# EasyEDA Pro project ProPrj_CyMouse.epro, schematic 主板
Board Name: 主板; Create Date: 2025-09-12; Page Name: P1; Project Name: CyMouse; Schematic Name: 主板; Update Date: 2025-09-17; Company: 嘉立创EDA; Page Size: A4; Version: V1.0
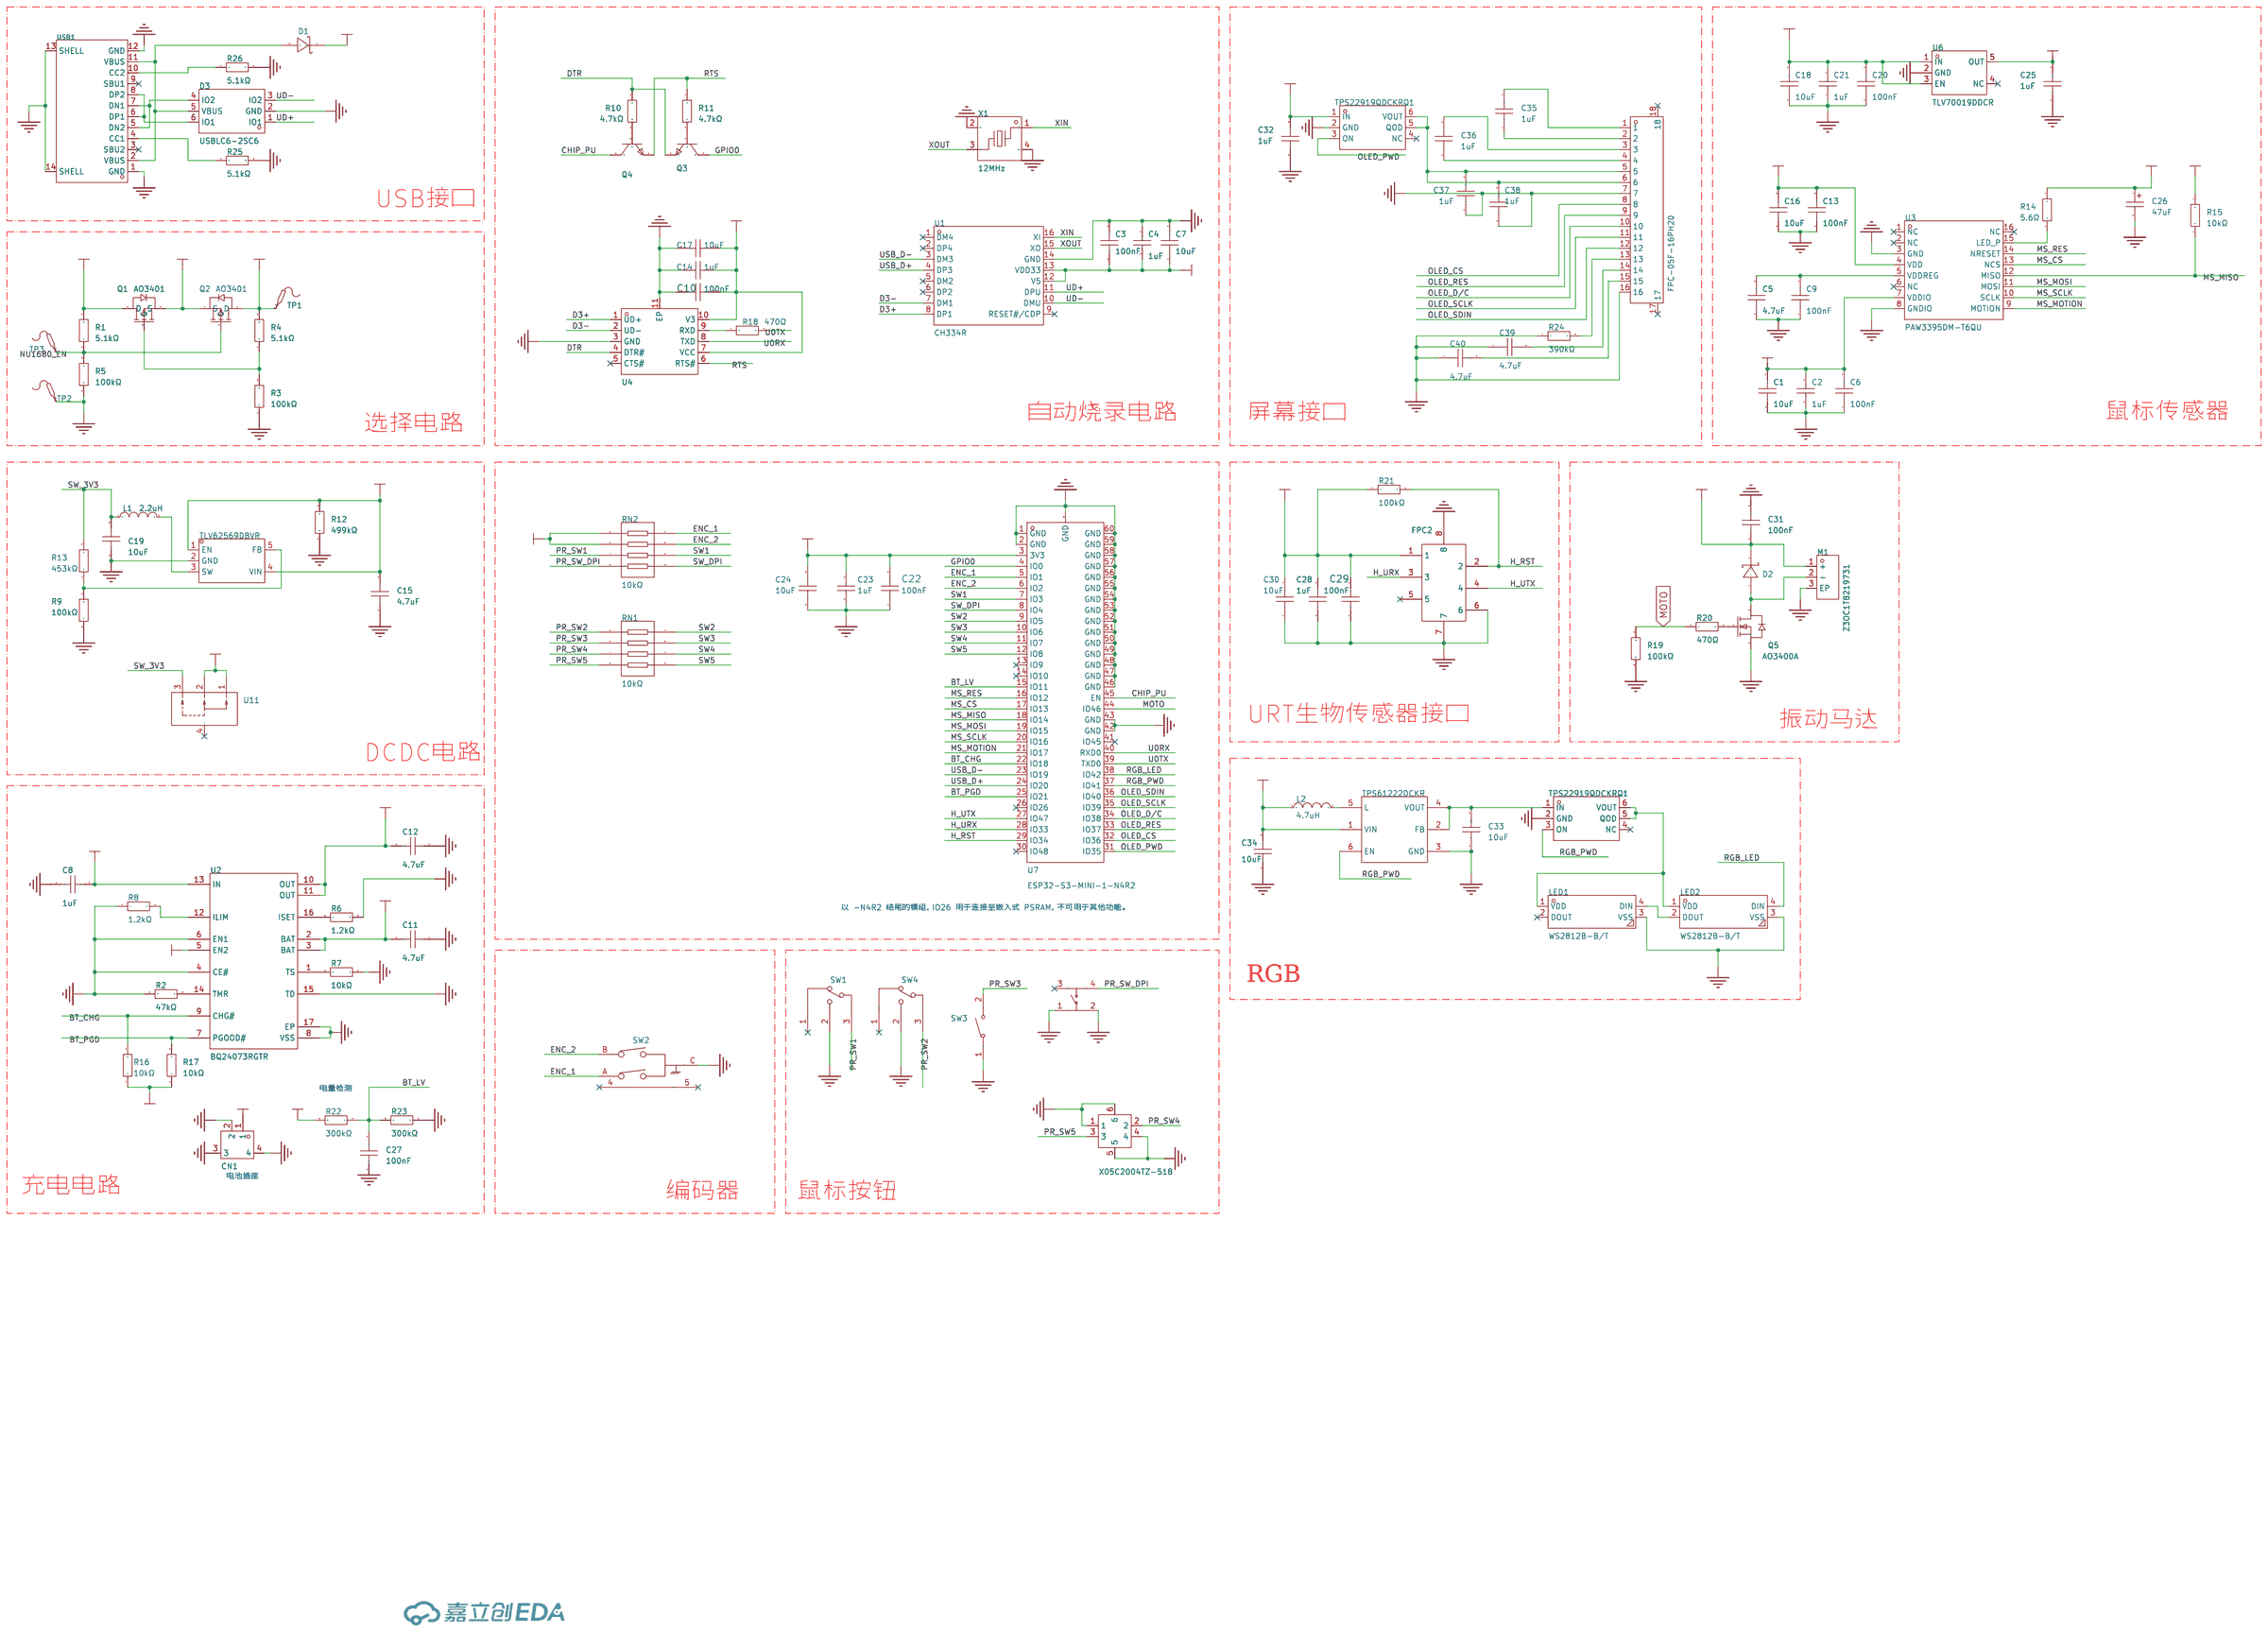
[diagram p0: schematic sheet]

## Parts
C1  10uF  [C0603]
C2  1uF  [C0603]
C3  100nF  [C0603]
C4  1uF  [C0603]
C5  4.7uF  [C0603]
C6  100nF  [C0603]
C7  10uF  [C0603]
C8  1uF  [C0603]
C9  100nF  [C0603]
C10  100nF  [C0603]
C11  4.7uF  [C0603]
C12  4.7uF  [C0603]
C13  100nF  [C0603]
C14  1uF  [C0603]
C15  4.7uF  [C0603]
C16  10uF  [C0603]
C17  10uF  [C0603]
C18  10uF  [C0603]
C19  10uF  [C0603]
C20  100nF  [C0603]
C21  1uF  [C0603]
C22  100nF  [C0603]
C23  1uF  [C0603]
C24  10uF  [C0603]
C25  1uF  [C0603]
C26  47uF  [CASE-A_3216]
C27  100nF  [C0603]
C28  1uF  [C0603]
C29  100nF  [C0603]
C30  10uF  [C0603]
C31  100nF  [C0603]
C32  1uF  [C0603]
C33  10uF  [C0603]
C34  10uF  [C0603]
C35  1uF  [C0603]
C36  1uF  [C0603]
C37  1uF  [C0603]
C38  1uF  [C0603]
C39  4.7uF  [C0603]
C40  4.7uF  [C0603]
CN1  WAFER-MX1.25-2PLB  [CONN-SMD_P1.25_M1250VS-02P]
D1  CUS10S30,H3F  [SOD-323_L1.8-W1.3-LS2.5-RD]
D2  CUS10S30,H3F  [SOD-323_L1.8-W1.3-LS2.5-RD]
D3  USBLC6-2SC6  [SOT-23-6_L2.9-W1.6-P0.95-LS2.8-BL]
DPI1  TS3315A  [SW-SMD_4P-L3.4-W3.4-P2.00-LS4.0]
FPC1  X05C2004TZ-518  [FPC-SMD_4P-P0.50_X05C2004TZ]
FPC2  AFC11-S06ICA-00  [FPC-SMD_6P-P0.50_AFC11-S06ICA-00]
FPC3  FPC-05F-16PH20  [FPC-SMD_16P-P0.50_FPC-05F-16PH20]
L1  2.2uH  [L0603]
L2  4.7uH  [L0603]
LED1  WS2812B-B/T  [LED-SMD_4P-L5.0-W5.0-TL_WS2812B-B]
LED2  WS2812B-B/T  [LED-SMD_4P-L5.0-W5.0-TL_WS2812B-B]
M1  Z3OC1T8219731  [VIBRATING-MOTOR-SMD_3P-C9900001680]
Q1  AO3401  [SOT-23-3_L2.9-W1.4-P1.90-LS2.6-BR]
Q2  AO3401  [SOT-23-3_L2.9-W1.4-P1.90-LS2.6-BR]
Q3  S8050 J3Y(RANGE:200-350)  [SOT-23-3_L3.0-W1.7-P0.95-LS2.9-BR]
Q4  S8050 J3Y(RANGE:200-350)  [SOT-23-3_L3.0-W1.7-P0.95-LS2.9-BR]
Q5  AO3400A  [SOT-23-3_L2.9-W1.3-P1.90-LS2.4-BR]
R1  5.1kΩ  [R0603]
R2  47kΩ  [R0603]
R3  100kΩ  [R0603]
R4  5.1kΩ  [R0603]
R5  100kΩ  [R0603]
R6  1.2kΩ  [R0603]
R7  10kΩ  [R0603]
R8  1.2kΩ  [R0603]
R9  100kΩ  [R0603]
R10  4.7kΩ  [R0603]
R11  4.7kΩ  [R0603]
R12  499kΩ  [R0603]
R13  453kΩ  [R0603]
R14  5.6Ω  [R0603]
R15  10kΩ  [R0603]
R16  10kΩ  [R0603]
R17  10kΩ  [R0603]
R18  470Ω  [R0603]
R19  100kΩ  [R0603]
R20  470Ω  [R0603]
R21  100kΩ  [R0603]
R22  300kΩ  [R0603]
R23  300kΩ  [R0603]
R24  390kΩ  [R0603]
R25  5.1kΩ  [R0603]
R26  5.1kΩ  [R0603]
RN1  10kΩ  [RES-ARRAY-SMD_0603-8P-L3.2-W1.6-BL]
RN2  10kΩ  [RES-ARRAY-SMD_0603-8P-L3.2-W1.6-BL]
SW1  K9-1267T  [SW-TH_K9-1267T]  (no BOM)
SW2  EC10E1220501  [SW-TH_EC10EXXXXXXX]  (no BOM)
SW3  CMI621101D01  [SW-TH_L6.2-W6.2-P5.00]  (no BOM)
SW4  K9-1267T  [SW-TH_K9-1267T]  (no BOM)
TP1  -  [Test-Point-0.5mm]  (no BOM)
TP2  -  [Test-Point-0.5mm]  (no BOM)
TP3  -  [Test-Point-0.5mm]  (no BOM)
U1  CH334R  [QSOP-16_L4.9-W3.9-P0.64-LS6.0-BL]
U2  BQ24073RGTR  [QFN-16_L3.0-W3.0-P0.50-TL-EP1.7]
U3  PAW3395DM-T6QU  [DIP-16_PAW3395DM-T6QU]  (no BOM)
U4  CH340K  [ESOP-10_L4.9-W3.9-P1.00-LS6.2-BL-EP]
U5  TLV62569DBVR  [SOT-23-5_L3.0-W1.7-P0.95-LS2.8-BR]
U6  TLV70019DDCR  [SOT-23-5_L2.9-W1.6-P0.95-LS2.8-BR]
U7  ESP32-S3-MINI-1-N4R2  [BULETM-SMD_ESP32-S3-MINI-1-N8]
U8  TPS22919QDCKRQ1  [SC-70-6_L2.0-W1.3-P0.65-LS2.1-BR]
U9  TPS61222DCKR  [SC-70-6_L2.2-W1.3-P0.65-LS2.1-BR]
U10  TPS22919QDCKRQ1  [SC-70-6_L2.0-W1.3-P0.65-LS2.1-BR]
U11  MSS12C02LS-BB2.0  [SW-SMD_MSS12C02LS-HB2.0-1]
USB1  TYPE-C 16PIN 2MD(073)  [USB-C-SMD_TYPE-C-6PIN-2MD-073]
X1  12MHz  [CRYSTAL-SMD_4P-L2.5-W2.0-BL-A]

## Library data of the parts
C1 C7 C16-C19 C24 C30 C33 C34 = CL10A106KP8NNNC: 容值:10uF;精度:±10%;额定电压:10V;材质(温度系数):X5R;; LCSC Part Name: 10uF ±10% 10V; Supplier Part: C19702; Manufacturer: SAMSUNG(三星); Supplier Footprint: 0603; JLCPCB Part Class: Basic Part; Datasheet: https://atta.szlcsc.com/upload/public/pdf/source/20160218/1457707763339.pdf; Supplier: LCSC; Tolerance: ±10%; Voltage Rated: 10V; Temperature Coefficient: X5R
C2 C4 C8 C14 C21 C23 C25 C28 C32 C35-C38 = CL10A105KO8NNNC: 容值:1uF;精度:±10%;额定电压:16V;材质(温度系数):X5R;; LCSC Part Name: 1uF ±10% 16V; Supplier Part: C1592; Manufacturer: SAMSUNG(三星); Supplier Footprint: 0603; JLCPCB Part Class: Extended Part; Datasheet: https://atta.szlcsc.com/upload/public/pdf/source/20220919/9FBE606BE0D9532D730F292EB26DC5BB.pdf; Supplier: LCSC; Tolerance: ±10%; Voltage Rated: 16V; Temperature Coefficient: X5R
C3 C6 C9 C10 C13 C20 C22 C27 C29 C31 = CL10B104JB8NNNC: 容值:100nF;精度:±5%;额定电压:50V;材质(温度系数):X7R;; LCSC Part Name: 100nF ±5% 50V; Supplier Part: C24452; Manufacturer: SAMSUNG(三星); Supplier Footprint: 0603; JLCPCB Part Class: Extended Part; Datasheet: https://atta.szlcsc.com/upload/public/pdf/source/20160218/1457707763339.pdf; Supplier: LCSC; Tolerance: ±5%; Voltage Rated: 50V; Temperature Coefficient: X7R
C5 C11 C12 C15 C39 C40 = CL10A475KP8NNNC: 容值:4.7uF;精度:±10%;额定电压:10V;材质(温度系数):X5R;; LCSC Part Name: 4.7uF ±10% 10V; Supplier Part: C1705; Manufacturer: SAMSUNG(三星); Supplier Footprint: 0603; JLCPCB Part Class: Extended Part; Datasheet: https://atta.szlcsc.com/upload/public/pdf/source/20160218/1457707763339.pdf; Supplier: LCSC; Tolerance: ±10%; Voltage Rated: 10V; Temperature Coefficient: X5R
C26 = TAJA476K006RNJ: 容值:47uF;精度:±10%;额定电压:6.3V;等效串联电阻(ESR):1.6Ω@100kHz;; LCSC Part Name: 47uF ±10% 6.3V; Supplier Part: C7190; Manufacturer: Kyocera AVX; Supplier Footprint: CASE-A-3216-18(mm); JLCPCB Part Class: 扩展库; Supplier: LCSC; Tolerance: ±10%; Voltage Rating: 6.3V; Equivalent Series Resistance(ESR): 1.6Ω@100kHz; Operating Temperature: -55℃~+125℃
CN1 = WAFER-MX1.25-2PLB: 插针结构:1x2P;间距:1.25mm;安装方式:立贴;参考系列:PicoBlade(MX 1.25);总PIN数:2P;排数:1;每排PIN数:2;行距:-;额定电流:1A;触头材质:黄铜;触头镀层:-;工作温度:-25℃~+85℃;; LCSC Part Name: 1x2P 间距:1.25mm 立贴 系列:PicoBlade(MX 1.25); Supplier Part: C3029350; Manufacturer: XUNPU(讯普); Supplier Footprint: SMD,P=1.25mm; JLCPCB Part Class: Extended Part; Datasheet: https://atta.szlcsc.com/upload/public/pdf/source/20220527/722C84F7ADABCD7FBF13D454629E8231.pdf; Supplier: LCSC; Pins Structure: 1x2P; Pitch: 1.25mm; Mounting Type: 立贴; Reference Series: PicoBlade(MX 1.25); Number of Pins: 2P; Number of Rows: 1; Number of PINs Per Row: 2; Current Rating: 1A; Contact Material: 黄铜; Operating Temperature: -25℃~+85℃; Voltage Rating: 125V; Plastic Material: LCP; Supplementary Features: 辅助焊脚; Color: 米色; Z-Height of the Board: 4.7mm; X-Length of Bottom Edge on Board (Spacing Line): 7.5mm; Y-Width of Bottom Edge on Board: 4.3mm
D1 D2 = CUS10S30,H3F: 正向压降(Vf):230mV@100mA;直流反向耐压(Vr):30V;平均整流电流(Io):1A;; LCSC Part Name: 电压:30V 电流:1A; Supplier Part: C146335; Manufacturer: TOSHIBA(东芝); Supplier Footprint: SC-76(SOD-323); JLCPCB Part Class: Extended Part; Datasheet: https://atta.szlcsc.com/upload/public/pdf/source/20171211/C146335_15129763734771175369.pdf; Supplier: LCSC; Forward Voltage (Vf@If): 230mV@100mA; Reverse Voltage (Vr): 30V; Average Rectified Current (Io): 1A; Reverse Leakage Current (Ir): 500uA@30V
D3 = USBLC6-2SC6_C2827654: 极性:单向;反向截止电压(Vrwm):5V;最大钳位电压:12V;峰值脉冲电流(Ipp):6A;峰值脉冲功率(Ppp):150W;击穿电压:6V;; LCSC Part Name: ESD，可防30kV静电; Supplier Part: C2827654; Manufacturer: TECH PUBLIC(台舟); Supplier Footprint: SOT-23-6; JLCPCB Part Class: Extended Part; Datasheet: https://atta.szlcsc.com/upload/public/pdf/source/20210810/FBD75DE717D6D97BAC6DD7F2B5C09DCD.pdf; Supplier: LCSC; polarity: 单向; Reverse Stand-Off Voltage (Vrwm): 5V; Maximum Clamping Voltage: 12V; Peak Pulse Current (Ipp): 6A; Peak Pulse Power Dissipation (Ppp): 150W; Breakdown Voltage: 6V; Reverse Leakage Current (Ir): 80nA; Number of Lines: 双路; Operating Temperature: -55℃~+125℃; level of protection: IEC 61000-4-2; Type: ESD
DPI1 = TS3315A: 电路结构:单刀单掷;按钮形状:圆形按钮;作用力:5N;安装方式:立贴;开关长度:3.3mm;开关宽度:3.3mm;开关高度:1.5mm;带支架:-;触点电流:50mA;额定电压(AC):-;额定电压(DC):12V;额定功率:-;绝缘电阻:-;带灯:-;机械寿命:-;; LCSC Part Name: 3.3*3.3*1.5mm 立贴 轻触开关; Supplier Part: C412367; Manufacturer: SHOU HAN(首韩); Supplier Footprint: SMD,3.3x3.3mm; JLCPCB Part Class: Extended Part; Datasheet: https://atta.szlcsc.com/upload/public/pdf/source/20190816/C412367_ADDBB226FF931702D65874676D89E2B9.pdf; Supplier: LCSC; Circuit: 单刀单掷; Actuator Style: 圆形按钮; Operating Force: 5N; Mounting Style: 立贴; Switch Length: 3.3mm; Switch Width: 3.3mm; Switch Height: 1.5mm; Contact Current: 50mA; Voltage Rating (DC): 12V
FPC1 = X05C2004TZ: 锁定特性:抽屉式;触点类型:单侧触点/垂直;触点数量:4P;间距:0.5mm;安装方式:立贴;工作温度:-40℃~+85℃;; LCSC Part Name: 间距:0.5mm P数:4P 抽屉式 单侧触点/垂直; Supplier Part: C397314; Manufacturer: XKB Connection(中国星坤); Supplier Footprint: SMD,P=0.5mm; JLCPCB Part Class: Extended Part; Datasheet: https://item.szlcsc.com/datasheet/X05C2004TZ-518/378892.html; Supplier: LCSC; Locking Feature: 抽屉式; Contact Type: 单侧触点/垂直; Number of Contacts: 4P; Pitch: 0.5mm; Mounting Type: 立贴; FFC, FCB Thickness: 0.3mm; Height Above Board: 2mm; Contact Material: 磷青铜; Contact Plating: 锡; Operating Temperature: -40℃~+85℃
FPC2 = AFC11-S06ICA-00: 锁定特性:抽屉式;触点类型:单侧触点/垂直;触点数量:6P;间距:0.5mm;安装类型:立贴;; LCSC Part Name: 间距:0.5mm P数:6P 抽屉式 单侧触点/垂直; Supplier Part: C262496; Manufacturer: JS(钜硕电子); Supplier Footprint: SMD,P=0.5mm; JLCPCB Part Class: 扩展库; Datasheet: https://atta.szlcsc.com/upload/public/pdf/source/20191211/C466537_F6F2472ADACFFA77E875AFE9DAB8E0AD.pdf; Supplier: LCSC; Locking Feature: 抽屉式; Contact Type: 单侧触点/垂直; Number of Contacts: 6P; Pitch: 0.5mm; Mounting Type: 立贴; FFC, FCB Thickness: 0.3mm; Height Above Board: 4.4mm
FPC3 = FPC-05F-16PH20: 锁定特性:翻盖式;触点类型:下接;触点数量:16P;间距:0.5mm;安装类型:卧贴;工作温度范围:-25℃~+85℃;; LCSC Part Name: 间距:0.5mm P数:16P 翻盖式 下接; Supplier Part: C2856801; Manufacturer: XUNPU(讯普); Supplier Footprint: SMD,P=0.5mm,卧贴; JLCPCB Part Class: 扩展库; Datasheet: https://atta.szlcsc.com/upload/public/pdf/source/20210922/C2856801_73A554E58C5577257FCEC843978D3BA6.pdf; Supplier: LCSC; Locking Feature: 翻盖式; Contact Type: 下接; Number of Contacts: 16P; Pitch: 0.5mm; Mounting Type: 卧贴; FFC, FCB Thickness: 0.3mm; Height Above Board: 2mm; Operating Temperature Range: -25℃~+85℃
L1 = LQM18PN2R2MFRL: 电感值:2.2uH;精度:±20%;额定电流:750mA;饱和电流(Isat):-;直流电阻(DCR):300mΩ;; LCSC Part Name: 2.2uH ±20%; Supplier Part: C337910; Manufacturer: muRata(村田); Supplier Footprint: 0603; JLCPCB Part Class: Extended Part; Datasheet: https://atta.szlcsc.com/upload/public/pdf/source/20190301/C337910_27DA25781C95F885577870A93A746ADF.pdf; Supplier: LCSC; Tolerance: ±20%; Rated Current: 750mA; DC Resistance (DCR): 300mΩ; Frequency - Self Resonant: 70MHz
L2 = LQM18PN4R7MFRL: 电感值:4.7uH;精度:±20%;额定电流:620mA;饱和电流(Isat):-;直流电阻(DCR):440mΩ;; LCSC Part Name: 4.7uH ±20%; Supplier Part: C114862; Manufacturer: muRata(村田); Supplier Footprint: 0603; JLCPCB Part Class: Extended Part; Datasheet: https://atta.szlcsc.com/upload/public/pdf/source/20190906/C114862_C649894BBFA3713544D63EDDE3C83B81.pdf; Supplier: LCSC; Tolerance: ±20%; Rated Current: 620mA; DC Resistance (DCR): 440mΩ; Frequency - Self Resonant: 40MHz
LED1 LED2 = WS2812B-B/T: 黑支架，雾状，发光更均匀，适合黑色结构产品（注意防潮，请查阅规格书中对应具体内容）; LCSC Part Name: RGB三色; Supplier Part: C2761795; Manufacturer: worldsemi; Supplier Footprint: SMD5050; JLCPCB Part Class: 扩展库; Datasheet: https://atta.szlcsc.com/upload/public/pdf/source/20241202/30EABD03362326C22309ED3654C53350.pdf; Supplier: LCSC; Wavelength: 520nm；471nm；621nm
M1 = Z3OC1T8219731: 类型:圆柱直流马达;额定电压:2.7V;额定转速:14000±2500rpm;旋转方向:CW;; Supplier Part: C2894731; Manufacturer: KOTL(金龙机电); JLCPCB Part Class: 扩展库; Datasheet: https://atta.szlcsc.com/upload/public/pdf/source/20210908/21604D4C77F5141C93AFC2CF1DCB74B9.pdf; Supplier: LCSC; Type: 圆柱直流马达; Voltage Rating: 2.7V; Current Rating: 85mA; Rated Speed: 14000±2500rpm; Operating Temperature: -20℃~+70℃; Sense Of Rotation: CW; Rated Voltage: 2.7V; Rated Current: 85mA
Q1 Q2 = AO3401_C727156: 数量:1个P沟道;漏源电压(Vdss):30V;连续漏极电流(Id):4.2A;导通电阻(RDS(on)):65mΩ@10V,4.2A;耗散功率(Pd):350mW;阈值电压(Vgs(th)):1.3V;; LCSC Part Name: 1个P沟道 耐压:30V 电流:4.2A; Supplier Part: C727156; Manufacturer: TWGMC(迪嘉); Supplier Footprint: SOT-23; JLCPCB Part Class: Extended Part; Datasheet: https://item.szlcsc.com/datasheet/AO3401/774261.html; Supplier: LCSC; Type: 1个P沟道; Drain Source Voltage (Vdss): 30V; Continuous Drain Current (Id): 4.2A; Power Dissipation (Pd): 350mW; Drain Source On Resistance (RDS(on)@Vgs,Id): 65mΩ@10V,4.2A; Gate Threshold Voltage (Vgs(th)@Id): 1.3V@250uA; Reverse Transfer Capacitance (Crss@Vds): 77pF; Operating Temperature: -55℃~+150℃; Number: 1个P沟道; Drain to Source Voltage: 30V; Current - Continuous Drain(Id): 4.2A; RDS(on): 65mΩ@10V,4.2A; Pd - Power Dissipation: 350mW; Gate Threshold Voltage (Vgs(th)): 1.3V; Input Capacitance(Ciss): 954pF
Q3 Q4 = S8050 J3Y(RANGE:200-350): 晶体管类型:NPN;集电极电流(Ic):500mA;集射极击穿电压(Vceo):25V;耗散功率(Pd):300mW;直流电流增益(hFE):200@500mA,1V;; LCSC Part Name: H档(200-350); Supplier Part: C2146; Manufacturer: CJ(江苏长电/长晶); Supplier Footprint: SOT-23; JLCPCB Part Class: Basic Part; Datasheet: https://atta.szlcsc.com/upload/public/pdf/source/20231013/FF37B6A000E6CDA75C9C999D2E78731F.pdf; Supplier: LCSC; type: NPN; Current - Collector(Ic): 500mA; Collector - Emitter Voltage VCEO: 25V; Pd - Power Dissipation: 300mW; DC Current Gain: 200@500mA,1V; Transition frequency(fT): 150MHz; Current - Collector Cutoff: 100nA; Vce Saturation(VCE(sat)): 600mV; Operating Temperature: -55℃~+150℃
Q5 = AO3400A_C347475: 类型:1个N沟道;漏源电压(Vdss):30V;连续漏极电流(Id):5.8A;功率(Pd):1.4W;导通电阻(RDS(on)@Vgs,Id):35mΩ@10V,5.8A;阈值电压(Vgs(th)@Id):1.4V@250uA;; LCSC Part Name: 1个N沟道 耐压:30V 电流:5.8A; Supplier Part: C347475; Manufacturer: UMW(友台半导体); Supplier Footprint: SOT-23; JLCPCB Part Class: 扩展库; Datasheet: https://atta.szlcsc.com/upload/public/pdf/source/20231109/50AB4FB4D66E55864F9B8D027B723C9A.pdf; Supplier: LCSC; Type: 1个N沟道; Drain Source Voltage (Vdss): 30V; Continuous Drain Current (Id): 5.8A; Power Dissipation (Pd): 1.4W; Drain Source On Resistance (RDS(on)@Vgs,Id): 35mΩ@10V,5.8A; Gate Threshold Voltage (Vgs(th)@Id): 1.4V@250uA; Total Gate Charge (Qg@Vgs): 12nC@4.5V; Input Capacitance (Ciss@Vds): 1.05nF@15V; Operating Temperature: -55℃~+150℃@(Tj)
R1 R4 R25 R26 = 0603WAF5101T5E: 电阻类型:厚膜电阻;阻值:5.1kΩ;精度:±1%;功率:100mW;最大工作电压:75V;温度系数:±100ppm/℃;; LCSC Part Name: 5.1kΩ ±1% 100mW 厚膜电阻; Supplier Part: C23186; Manufacturer: UNI-ROYAL(厚声); Supplier Footprint: 0603; JLCPCB Part Class: Basic Part; Datasheet: https://atta.szlcsc.com/upload/public/pdf/source/20200306/C422600_1E6D84923E4A46A82E41ADD87F860B5C.pdf; Supplier: LCSC; Type: 厚膜电阻; Tolerance: ±1%; Power(Watts): 100mW; Overload Voltage (Max): 75V; Temperature Coefficient: ±100ppm/℃; Operating Temperature Range: -55℃~+155℃
R2 = FRC0603F4702TS: 电阻类型:厚膜电阻;阻值:47kΩ;精度:±1%;功率:100mW;最大工作电压:75V;温度系数:±100ppm/℃;; LCSC Part Name: 47kΩ ±1% 100mW 厚膜电阻; Supplier Part: C2907042; Manufacturer: FOJAN(富捷); Supplier Footprint: 0603; JLCPCB Part Class: Extended Part; Datasheet: https://atta.szlcsc.com/upload/public/pdf/source/20211221/925EC7D7225764EE0046F22065062C87.pdf; Supplier: LCSC; Type: 厚膜电阻; Tolerance: ±1%; Power(Watts): 100mW; Overload Voltage (Max): 75V; Temperature Coefficient: ±100ppm/℃; Operating Temperature Range: -55℃~+155℃
R3 R5 R9 R19 R21 = 0603WAF1003T5E: 电阻类型:厚膜电阻;阻值:100kΩ;精度:±1%;功率:100mW;最大工作电压:75V;温度系数:±100ppm/℃;; LCSC Part Name: 100kΩ ±1% 100mW 厚膜电阻; Supplier Part: C25803; Manufacturer: UNI-ROYAL(厚声); Supplier Footprint: 0603; JLCPCB Part Class: Basic Part; Datasheet: https://atta.szlcsc.com/upload/public/pdf/source/20200306/C422600_1E6D84923E4A46A82E41ADD87F860B5C.pdf; Supplier: LCSC; Type: 厚膜电阻; Tolerance: ±1%; Power(Watts): 100mW; Overload Voltage (Max): 75V; Temperature Coefficient: ±100ppm/℃; Operating Temperature Range: -55℃~+155℃
R6 R8 = 0603WAF1201T5E: 电阻类型:厚膜电阻;阻值:1.2kΩ;精度:±1%;功率:100mW;最大工作电压:75V;温度系数:±100ppm/℃;; LCSC Part Name: 1.2kΩ ±1% 100mW 厚膜电阻; Supplier Part: C22765; Manufacturer: UNI-ROYAL(厚声); Supplier Footprint: 0603; JLCPCB Part Class: Basic Part; Datasheet: https://atta.szlcsc.com/upload/public/pdf/source/20200306/C422600_1E6D84923E4A46A82E41ADD87F860B5C.pdf; Supplier: LCSC; Type: 厚膜电阻; Tolerance: ±1%; Power(Watts): 100mW; Overload Voltage (Max): 75V; Temperature Coefficient: ±100ppm/℃; Operating Temperature Range: -55℃~+155℃
R7 R15-R17 = 0603WAF1002T5E: 电阻类型:厚膜电阻;阻值:10kΩ;精度:±1%;功率:100mW;最大工作电压:75V;温度系数:±100ppm/℃;; LCSC Part Name: 厚膜电阻 10kΩ ±1% 100mW; Supplier Part: C25804; Manufacturer: UNI-ROYAL(厚声); Supplier Footprint: 0603; JLCPCB Part Class: Basic Part; Datasheet: https://atta.szlcsc.com/upload/public/pdf/source/20200306/C422600_1E6D84923E4A46A82E41ADD87F860B5C.pdf; Supplier: LCSC; Type: 厚膜电阻; Tolerance: ±1%; Power(Watts): 100mW; Overload Voltage (Max): 75V; Temperature Coefficient: ±100ppm/℃; Operating Temperature Range: -55℃~+155℃
R10 R11 = 0603WAF4701T5E: 电阻类型:厚膜电阻;阻值:4.7kΩ;精度:±1%;功率:100mW;最大工作电压:75V;温度系数:±100ppm/℃;; LCSC Part Name: 4.7kΩ ±1% 100mW 厚膜电阻; Supplier Part: C23162; Manufacturer: UNI-ROYAL(厚声); Supplier Footprint: 0603; JLCPCB Part Class: Basic Part; Datasheet: https://atta.szlcsc.com/upload/public/pdf/source/20200306/C422600_1E6D84923E4A46A82E41ADD87F860B5C.pdf; Supplier: LCSC; Type: 厚膜电阻; Tolerance: ±1%; Power(Watts): 100mW; Overload Voltage (Max): 75V; Temperature Coefficient: ±100ppm/℃; Operating Temperature Range: -55℃~+155℃
R12 = 0603WAF4993T5E: 电阻类型:厚膜电阻;阻值:499kΩ;精度:±1%;功率:100mW;最大工作电压:75V;温度系数:±100ppm/℃;; LCSC Part Name: 499kΩ ±1% 100mW 厚膜电阻; Supplier Part: C26751; Manufacturer: UNI-ROYAL(厚声); Supplier Footprint: 0603; JLCPCB Part Class: Extended Part; Datasheet: https://atta.szlcsc.com/upload/public/pdf/source/20200306/C422600_1E6D84923E4A46A82E41ADD87F860B5C.pdf; Supplier: LCSC; Type: 厚膜电阻; Tolerance: ±1%; Power(Watts): 100mW; Overload Voltage (Max): 75V; Temperature Coefficient: ±100ppm/℃; Operating Temperature Range: -55℃~+155℃
R13 = 0603WAF4533T5E: 电阻类型:厚膜电阻;阻值:453kΩ;精度:±1%;功率:100mW;最大工作电压:75V;温度系数:±100ppm/℃;; LCSC Part Name: 453kΩ ±1% 100mW 厚膜电阻; Supplier Part: C25818; Manufacturer: UNI-ROYAL(厚声); Supplier Footprint: 0603; JLCPCB Part Class: Extended Part; Datasheet: https://atta.szlcsc.com/upload/public/pdf/source/20200306/C422600_1E6D84923E4A46A82E41ADD87F860B5C.pdf; Supplier: LCSC; Type: 厚膜电阻; Tolerance: ±1%; Power(Watts): 100mW; Overload Voltage (Max): 75V; Temperature Coefficient: ±100ppm/℃; Operating Temperature Range: -55℃~+155℃
R14 = 0603WAF560KT5E: 电阻类型:厚膜电阻;阻值:5.6Ω;精度:±1%;功率:100mW;最大工作电压:75V;温度系数:±200ppm/℃;; LCSC Part Name: 5.6Ω ±1% 100mW 厚膜电阻; Supplier Part: C23191; Manufacturer: UNI-ROYAL(厚声); Supplier Footprint: 0603; JLCPCB Part Class: Extended Part; Datasheet: https://atta.szlcsc.com/upload/public/pdf/source/20200306/C422600_1E6D84923E4A46A82E41ADD87F860B5C.pdf; Supplier: LCSC; Type: 厚膜电阻; Tolerance: ±1%; Power(Watts): 100mW; Overload Voltage (Max): 75V; Temperature Coefficient: ±200ppm/℃; Operating Temperature Range: -55℃~+155℃
R18 R20 = 0603WAF4700T5E: 电阻类型:厚膜电阻;阻值:470Ω;精度:±1%;功率:100mW;最大工作电压:75V;温度系数:±100ppm/℃;; LCSC Part Name: 470Ω ±1% 100mW 厚膜电阻; Supplier Part: C23179; Manufacturer: UNI-ROYAL(厚声); Supplier Footprint: 0603; JLCPCB Part Class: Basic Part; Datasheet: https://atta.szlcsc.com/upload/public/pdf/source/20200306/C422600_1E6D84923E4A46A82E41ADD87F860B5C.pdf; Supplier: LCSC; Type: 厚膜电阻; Tolerance: ±1%; Power(Watts): 100mW; Overload Voltage (Max): 75V; Temperature Coefficient: ±100ppm/℃; Operating Temperature Range: -55℃~+155℃
R22 R23 = 0603WAF3003T5E: 电阻类型:厚膜电阻;阻值:300kΩ;精度:±1%;功率:100mW;最大工作电压:75V;温度系数:±100ppm/℃;; LCSC Part Name: 300kΩ ±1% 100mW 厚膜电阻; Supplier Part: C23024; Manufacturer: UNI-ROYAL(厚声); Supplier Footprint: 0603; JLCPCB Part Class: Basic Part; Datasheet: https://atta.szlcsc.com/upload/public/pdf/source/20200306/C422600_1E6D84923E4A46A82E41ADD87F860B5C.pdf; Supplier: LCSC; Type: 厚膜电阻; Tolerance: ±1%; Power(Watts): 100mW; Overload Voltage (Max): 75V; Temperature Coefficient: ±100ppm/℃; Operating Temperature Range: -55℃~+155℃
R24 = 0603WAF3903T5E: 电阻类型:厚膜电阻;阻值:390kΩ;精度:±1%;功率:100mW;最大工作电压:75V;温度系数:±100ppm/℃;; LCSC Part Name: 390kΩ ±1% 100mW 厚膜电阻; Supplier Part: C23150; Manufacturer: UNI-ROYAL(厚声); Supplier Footprint: 0603; JLCPCB Part Class: Extended Part; Datasheet: https://atta.szlcsc.com/upload/public/pdf/source/20200306/C422600_1E6D84923E4A46A82E41ADD87F860B5C.pdf; Supplier: LCSC; Type: 厚膜电阻; Tolerance: ±1%; Power(Watts): 100mW; Overload Voltage (Max): 75V; Temperature Coefficient: ±100ppm/℃; Operating Temperature Range: -55℃~+155℃
RN1 RN2 = YC164-FR-0710KL: 电阻器数:4;阻值:10kΩ;精度:±1%;单个元件功率:62.5mW;温度系数:±200ppm/℃;; LCSC Part Name: 10kΩ ±1% 0603x4; Supplier Part: C110924; Manufacturer: YAGEO(国巨); Supplier Footprint: 0603x4; JLCPCB Part Class: 扩展库; Datasheet: https://atta.szlcsc.com/upload/public/pdf/source/20170912/C110924_1505207735334963352.pdf; Supplier: LCSC; Number of Resistors: 4; Tolerance: ±1%; Power(Watts): 62.5mW; Temperature Coefficient: ±200ppm/℃; Number of Pins: 8
SW1 SW4 = K9-1267T: 类型:微动开关;电路结构:单刀双掷;额定电流(DC):100mA;额定电压(DC):30V;额定电流(AC):-;额定电压(AC):-;机械寿命:300万次;; LCSC Part Name: 12.7*5.7*7.5mm 插件微动开关; Supplier Part: C107266; Manufacturer: 韩国韩荣; Supplier Footprint: 插件; JLCPCB Part Class: 扩展库; Datasheet: https://atta.szlcsc.com/upload/public/pdf/source/20170413/1492062748888.pdf; Supplier: LCSC; Type: 微动开关; Circuit: 单刀双掷; Switch Length: 12.7mm; Switch Width: 5.7mm; Switch Height: 7.5mm; Contact Current (DC): 100mA; Voltage Rating (DC): 30V; Mechanical Life: 300万次; Operating Temperature: -25℃~+85℃
SW2 = EC10E1220501: 10型贯通轴型; Supplier Part: C160889; Manufacturer: ALPSALPINE(阿尔卑斯阿尔派); Supplier Footprint: 插件; JLCPCB Part Class: 扩展库; Datasheet: https://atta.szlcsc.com/upload/public/pdf/source/20180227/C160889_15197014267581370273.pdf; Supplier: LCSC
SW3 = CMI621101D01: Supplier Part: C400269; Manufacturer: Kailh(凯华); Supplier Footprint: 插件; JLCPCB Part Class: Extended Part; Datasheet: https://atta.szlcsc.com/upload/public/pdf/source/20190626/C400269_AFEF00833BA31A55037065A2F8D3A334.pdf; Supplier: LCSC
TP1-TP3 = Test-Point: Test Point 测试点
U1 = CH334R: Supplier Part: C4154405; Manufacturer: WCH(南京沁恒); Supplier Footprint: QSOP-16-150mil; JLCPCB Part Class: 扩展库; Datasheet: https://atta.szlcsc.com/upload/public/pdf/source/20240313/F70B229B132CE2CA6E618A7ACAF406E8.pdf; Supplier: LCSC
U2 = BQ24073RGTR: 工作电压:4.35V~6.6V;最大充电电流:-;电池类型:锂离子/聚合物;电池节数:1;; Supplier Part: C15220; Manufacturer: TI(德州仪器); Supplier Footprint: QFN-16-EP(3x3); JLCPCB Part Class: 扩展库; Datasheet: http://www.ti.com/cn/lit/gpn/bq24075; Supplier: LCSC; Voltage - Supply: 4.35V~6.6V; Charging Saturation Voltage: 4.2V; Type of Battery: 锂离子/聚合物; Number of Cells: 1; Operating Temperature: -40℃~+85℃
U3 = PAW3395DM-T6QU: Supplier Part: C9900026543; Supplier Footprint: 16-PDIP; Supplier: LCSC
U4 = CH340K: 应用功能:-;接口协议:-;; LCSC Part Name: CH340K USB转串口芯片 CH340; Supplier Part: C968586; Manufacturer: WCH(南京沁恒); Supplier Footprint: ESOP-10-EP-150mil; JLCPCB Part Class: 扩展库; Datasheet: https://atta.szlcsc.com/upload/public/pdf/source/20200819/C84681_ADBED554CE321879DBD6B1D06488689C.pdf; Supplier: LCSC
U5 = TLV62569DBVR: 功能类型:降压型;输出类型:可调;工作电压:2.5V~5.5V;输出电压:600mV~5.5V;输出电流:2A;; LCSC Part Name: 高效率同步降压转换器; Supplier Part: C141836; Manufacturer: TI(德州仪器); Supplier Footprint: SOT-23-5; JLCPCB Part Class: 扩展库; Datasheet: https://www.ti.com/cn/lit/gpn/tlv62569; Supplier: LCSC; Function: 降压型; Output Type: 可调; Voltage - Supply: 2.5V~5.5V; Output Voltage: 600mV~5.5V; Output Current: 2A; Frequency - Switching: 1.5MHz; Operating Temperature: -40℃~+125℃@(TJ); Synchronous Rectifier: 是; Number of Outputs: 1; Topology: 降压式; Switch tube (built-in/external): 内置
U6 = TLV70019DDCR: 输出类型:固定;最大输入电压:5.5V;输出电压:1.9V;输出电流:200mA;电源纹波抑制比(PSRR):68dB@(1kHz);输出极性:正极;; LCSC Part Name: 具有使能功能的 200mA、高 PSRR、低 IQ、低压降稳压器; Supplier Part: C2862411; Manufacturer: TI(德州仪器); Supplier Footprint: SOT-23-5; JLCPCB Part Class: 扩展库; Datasheet: https://www.ti.com/cn/lit/gpn/tlv700; Supplier: LCSC; Output Type: 固定; Maximum Input Voltage: 5.5V; Output Voltage: 1.9V; Output Current: 200mA; Power Supply Rejection Ratio (PSRR): 68dB@(1kHz); Dropout Voltage: 250mV@(200mA); standby current: 55uA; Feature: 防静电保护；低ESR；热保护(TSD)；欠压闭锁；过流保护(OCP)；带使能; Operating Temperature: -40℃~+125℃@(Tj); Output Polarity: 正极; Number of Outputs: 1
U7 = ESP32-S3-MINI-1-N4R2: 天线形式:板载PCB天线;; Supplier Part: C3013941; Manufacturer: ESPRESSIF(乐鑫); Supplier Footprint: SMD; JLCPCB Part Class: 扩展库; Datasheet: https://item.szlcsc.com/datasheet/ESP32-S3-MINI-1-N4R2/3522411.html; Supplier: LCSC; Antenna Type: 板载PCB天线
U8 U10 = TPS22919QDCKRQ1: 通道数:1;输出电流:1.5A;输入电压:1.6V~5.5V;导通电阻:89mΩ;; Supplier Part: C2871558; Manufacturer: TI(德州仪器); Supplier Footprint: SC-70-6; JLCPCB Part Class: 扩展库; Datasheet: https://www.ti.com/cn/lit/gpn/tps22919-q1; Supplier: LCSC; Number of Outputs: 1; Output Current: 1.5A; Input Voltage: 1.6V~5.5V; Resistor On-State: 89mΩ; Operating Temperature	-: -40℃~+125℃
U9 = TPS61222DCKR: 功能类型:升压型;输出类型:固定;工作电压:700mV~5.5V;输出电压:5V;输出电流:200mA;; LCSC Part Name: 低输入电压0.7V升压转换器; Supplier Part: C116461; Manufacturer: TI(德州仪器); Supplier Footprint: SC-70-6(SOT-363); JLCPCB Part Class: 扩展库; Datasheet: https://www.ti.com/cn/lit/gpn/tps61222; Supplier: LCSC; Function: 升压型; Output Type: 固定; Voltage - Supply: 700mV~5.5V; Output Voltage: 5V; Output Current: 200mA; Operating Temperature: -40℃~+125℃@(TJ); Synchronous Rectifier: 是; Number of Outputs: 1; Topology: 升压式; Switch tube (built-in/external): 内置
U11 = MSS12C02LS-BB2.0: 电路结构:单刀双掷;安装方式:立贴;开关颜色:-;额定电流(DC):100mA;额定电压(DC):12V;额定电流(AC):-;额定电压(AC):-;机械寿命:1万次;; Supplier Part: C3008585; Manufacturer: SHOU HAN(首韩); Supplier Footprint: SMD; JLCPCB Part Class: Extended Part; Datasheet: https://atta.szlcsc.com/upload/public/pdf/source/20220429/8AEFBC67104491914BC5659DE1F359A3.pdf; Supplier: LCSC; Circuit: 单刀双掷; Pin Style: SMD接片; Switch Length: 6.65mm; Switch Width: 2.75mm; Switch Height: 1.4mm; Mounting Style: 立贴; Current Rating (DC): 100mA; Voltage Rating (DC): 12V; Mechanical Life: 1万次; Operating Temperature: -25℃~+70℃
USB1 = TYPE-C 16PIN 2MD(073): 连接器类型:Type-C;标准:-;公母:母座;触点数量:16;端口数量:1;安装方式:卧贴;额定电流 - 电源:5A;工作温度范围:-25℃~+85℃;; LCSC Part Name: TYPE-C母座 16P 4脚插件带定位柱 不锈钢外壳 2次模顶; Supplier Part: C2765186; Manufacturer: SHOU HAN(首韩); Supplier Footprint: SMD; JLCPCB Part Class: Extended Part; Supplier: LCSC; Connector Type: Type-C; Gender: 母座; Number of Contacts: 16; Number of Ports: 1; Mounting Style: 卧贴; Current Rating - Power (Max): 5A; Operating Temperature Range: -25℃~+85℃
X1 = X252012MMB4SI-24: 频率:12MHz;频率公差:±10ppm;负载电容:10pF;; LCSC Part Name: 12MHz ±10ppm 10pF YSX221SL; Supplier Part: C2896601; Manufacturer: YXC(扬兴晶振); Supplier Footprint: SMD2520-4P; JLCPCB Part Class: 扩展库; Datasheet: https://atta.szlcsc.com/upload/public/pdf/source/20210917/7E0AFFDD74AE514FE25E1ADDD9E3C073.pdf; Supplier: LCSC; Crystal Type: 贴片无源晶振; Frequency Tolerance: ±10ppm; Frequency Stability: ±20ppm; Load Capacitance: 10pF; Operating Temperature: -40℃~+85℃

## Nets
1.9V: C13.2 C16.2 C25.2 C26.1 R14.2 U3.4(VDD) U6.5(OUT)
3V3: C1.2 C2.2 C3.1 C4.1 C6.2 C7.1 C10.1 C14.1 C17.1 C18.2 C20.2 C21.2 C22.2 C23.2 C24.2 C28.2 C29.2 C30.2 C31.1 C32.2 C34.2 D2.1(K) FPC2.1 L2.1 M1.1(+) R15.2 R16.1 R17.1 R21.1 RN2.5 RN2.6 U1.12(V5) U1.13(VDD33) U3.7(VDDIO) U4.7(VCC) U4.10(V3) U6.1(IN) U6.3(EN) U7.3(3V3) U8.1(IN) U9.1(VIN) U11.1 U11.2
5V: C12.2 C15.2 R12.2 U2.5(EN2) U2.10(OUT) U2.11(OUT) U5.1(EN) U5.4(VIN)
GND: C1.1 C2.1 C3.2 C4.2 C5.1 C6.1 C7.2 C8.2 C9.1 C10.2 C11.1 C12.1 C13.1 C14.2 C15.1 C16.1 C17.2 C18.1 C19.1 C20.1 C21.1 C22.1 C23.1 C24.1 C25.1 C26.2 C27.1 C28.1 C29.1 C30.1 C31.2 C32.1 C33.1 C34.1 C37.1 C38.1 C39.1 C40.1 CN1.2 CN1.3 CN1.4 D3.2(GND) DPI1.1 DPI1.2 FPC1.1 FPC1.4 FPC1.5 FPC1.6 FPC2.6 FPC2.7 FPC2.8 FPC3.7 FPC3.16 LED1.3(VSS) LED2.3(VSS) M1.3(EP) Q5.2(S) R2.1 R3.1 R5.1 R6.2 R7.1 R8.1 R9.1 R12.1 R19.1 R23.1 R24.1 R25.2 R26.2 SW1.2(ON) SW2.C SW3.1(A) SW4.2(ON) TP2.1 U1.14(GND) U2.4(CE#) U2.6(EN1) U2.8(VSS) U2.15(TD) U2.17(EP) U3.3(GND) U3.8(GNDIO) U4.3(GND) U4.11(EP) U5.2(GND) U6.2(GND) U7.1(GND) U7.2(GND) U7.42(GND) U7.43(GND) U7.46(GND) U7.47(GND) U7.48(GND) U7.49(GND) U7.50(GND) U7.51(GND) U7.52(GND) U7.53(GND) U7.54(GND) U7.55(GND) U7.56(GND) U7.57(GND) U7.58(GND) U7.59(GND) U7.60(GND) U7.GND U8.2(GND) U9.3(GND) U10.2(GND) USB1.1(GND) USB1.12(GND) USB1.13(SHELL) USB1.14(SHELL) X1.2(GND) X1.4(GND)
VBAT: C11.2 CN1.1 R22.2 U2.2(BAT) U2.3(BAT)
VBUS: D1.1(K) Q1.3(D) R1.2
BT_CHG: R16.2 U2.9(CHG#) U7.22(IO18)
BT_LV: C27.2 R22.1 R23.2 U7.15(IO11)
BT_PGD: R17.2 U2.7(PGOOD#) U7.25(IO21)
CHIP_PU: Q4.3(C) U7.45(EN)
D3+: U1.8(DP1) U4.1(UD+)
D3-: U1.7(DM1) U4.2(UD-)
DTR: Q3.2(E) R10.1 U4.4(DTR#)
ENC_1: RN2.4 SW2.A U7.5(IO1)
ENC_2: RN2.3 SW2.B U7.6(IO2)
GPIO0: Q3.3(C) U7.4(IO0)
H_RST: FPC2.2 R21.2 U7.29(IO34)
H_URX: FPC2.3 U7.28(IO33)
H_UTX: FPC2.4 U7.27(IO47)
MOTO: R19.2 R20.1 U7.44(IO46)
MS_CS: U3.13(NCS) U7.17(IO13)
MS_MISO: R15.1 U3.12(MISO) U7.18(IO14)
MS_MOSI: U3.11(MOSI) U7.19(IO15)
MS_MOTION: U3.9(MOTION) U7.21(IO17)
MS_RES: U3.14(NRESET) U7.16(IO12)
MS_SCLK: U3.10(SCLK) U7.20(IO16)
NU1680_EN: Q2.1(G) R1.1 R5.2 TP3.1
OLED_CS: FPC3.8 U7.32(IO36)
OLED_D/C: FPC3.10 U7.34(IO38)
OLED_PWD: U7.31(IO35) U8.3(ON)
OLED_RES: FPC3.9 U7.33(IO37)
OLED_SCLK: FPC3.11 U7.35(IO39)
OLED_SDIN: FPC3.12 U7.36(IO40)
PR_SW1: RN2.7 SW1.3(NC)
PR_SW2: RN1.5 SW4.3(NC)
PR_SW3: RN1.6 SW3.2(B)
PR_SW4: FPC1.2 RN1.7
PR_SW5: FPC1.3 RN1.8
PR_SW_DPI: DPI1.4 RN2.8
RGB_LED: LED2.4(DIN) U7.38(IO42)
RGB_PWD: U7.37(IO41) U9.6(EN) U10.3(ON)
RTS: Q4.2(E) R11.1 U4.6(RTS#)
SW1: RN2.2 U7.7(IO3)
SW2: RN1.4 U7.9(IO5)
SW3: RN1.3 U7.10(IO6)
SW4: RN1.2 U7.11(IO7)
SW5: RN1.1 U7.12(IO8)
SW_3V3: C19.2 L1.1 R13.2 U11.3
SW_DPI: RN2.1 U7.8(IO4)
U0RX: U4.8(TXD) U7.40(RXD0)
U0TX: R18.2 U7.39(TXD0)
UD+: D3.1(IO1) U1.11(DPU)
UD-: D3.3(IO2) U1.10(DMU)
USB_D+: U1.4(DP3) U7.24(IO20)
USB_D-: U1.3(DM3) U7.23(IO19)
VOUT: C8.1 Q1.2(S) Q2.2(S) U2.13(IN)
WBUS: Q2.3(D) R4.2 TP1.1
XIN: U1.16(XI) X1.1
XOUT: U1.15(XO) X1.3
$1N3031: R26.1 USB1.10(CC2)
$1N3032: R25.1 USB1.4(CC1)
$1N3042: D3.6(IO1) USB1.6(DP1) USB1.8(DP2)
$1N3043: D3.4(IO2) USB1.5(DN2) USB1.7(DN1)
$1N3045: D1.2(A) D3.5(VBUS) USB1.2(VBUS) USB1.11(VBUS)
$1N5320: Q4.1(B) R10.2
$1N5321: Q3.1(B) R11.2
$1N5356: R18.1 U4.9(RXD)
$1N6254: D2.2(A) M1.2(-) Q5.3(D)
$1N7553: C5.2 C9.2 U3.5(VDDREG)
$1N7571: R14.1 U3.15(LED_P)
$1N60166: Q1.1(G) R3.2 R4.1
$1N85866: C35.2 FPC3.1
$1N85867: C35.1 FPC3.2
$1N85868: C36.1 FPC3.4
$1N85869: C36.2 FPC3.3
$1N85880: C40.2 FPC3.15
$1N85884: C39.2 FPC3.14
$1N85933: FPC3.13 R24.2
$1N130397: Q5.1(G) R20.2
$1N147084: L1.2 U5.3(SW)
$1N147367: R9.2 R13.1 U5.5(FB)
$1N156146: R8.2 U2.12(ILIM)
$1N190580: LED1.4(DIN) LED2.2(DOUT)
$1N282636: C37.2 C38.2 FPC3.5 FPC3.6 U8.5(QOD) U8.6(VOUT)
$1N290073: C33.2 U9.2(FB) U9.4(VOUT) U10.1(IN)
$1N290075: L2.2 U9.5(L)
$1N290162: LED1.1(VDD) LED2.1(VDD) U10.5(QOD) U10.6(VOUT)
$1N342149: R6.1 U2.16(ISET)
$1N342151: R2.2 U2.14(TMR)
$1N342153: R7.2 U2.1(TS)

Not connected (* = marked no-connect by the designer): DPI1 3*; FPC2 5*; FPC3 17* 18*; LED1 2(DOUT)*; SW1 1(C)*; SW2 4* 5*; SW4 1(C)*; U1 1(DM4)* 2(DP4)* 5(DM2)* 6(DP2)* 9(RESET#/CDP)*; U3 1(NC)* 2(NC)* 6(NC)* 16(NC)*; U4 5(CTS#)*; U6 4(NC)*; U7 13(IO9)* 14(IO10)* 26(IO26)* 30(IO48)* 41(IO45)*; U8 4(NC)*; U10 4(NC)*; U11 4*; USB1 3(SBU2)* 9(SBU1)*

## Notes on the sheet
- USB接口
- 鼠标传感器
- 自动烧录电路
- 屏幕接口
- 选择电路
- URT生物传感器接口
- 振动马达
- DCDC电路
- 以 -N4R2 结尾的模组，IO26 用于连接至嵌入式 PSRAM，不可用于其他功能。
- RGB
- 电量检测
- 电池插座
- 充电电路
- 编码器
- 鼠标按钮
